# Altium schematic sheet Sheet3.SchDoc
size 431 x 279 mm; Organization: ORGANIZATION; Address1: ADDRESS 1; Address2: ADDRESS 2; Address3: ADDRESS 3; Address4: ADDRESS 4; Revision: -; ENG_APP_DATE: --/--/--; DSN_APP_DATE: --/--/--; CHK_APP_DATE: --/--/--
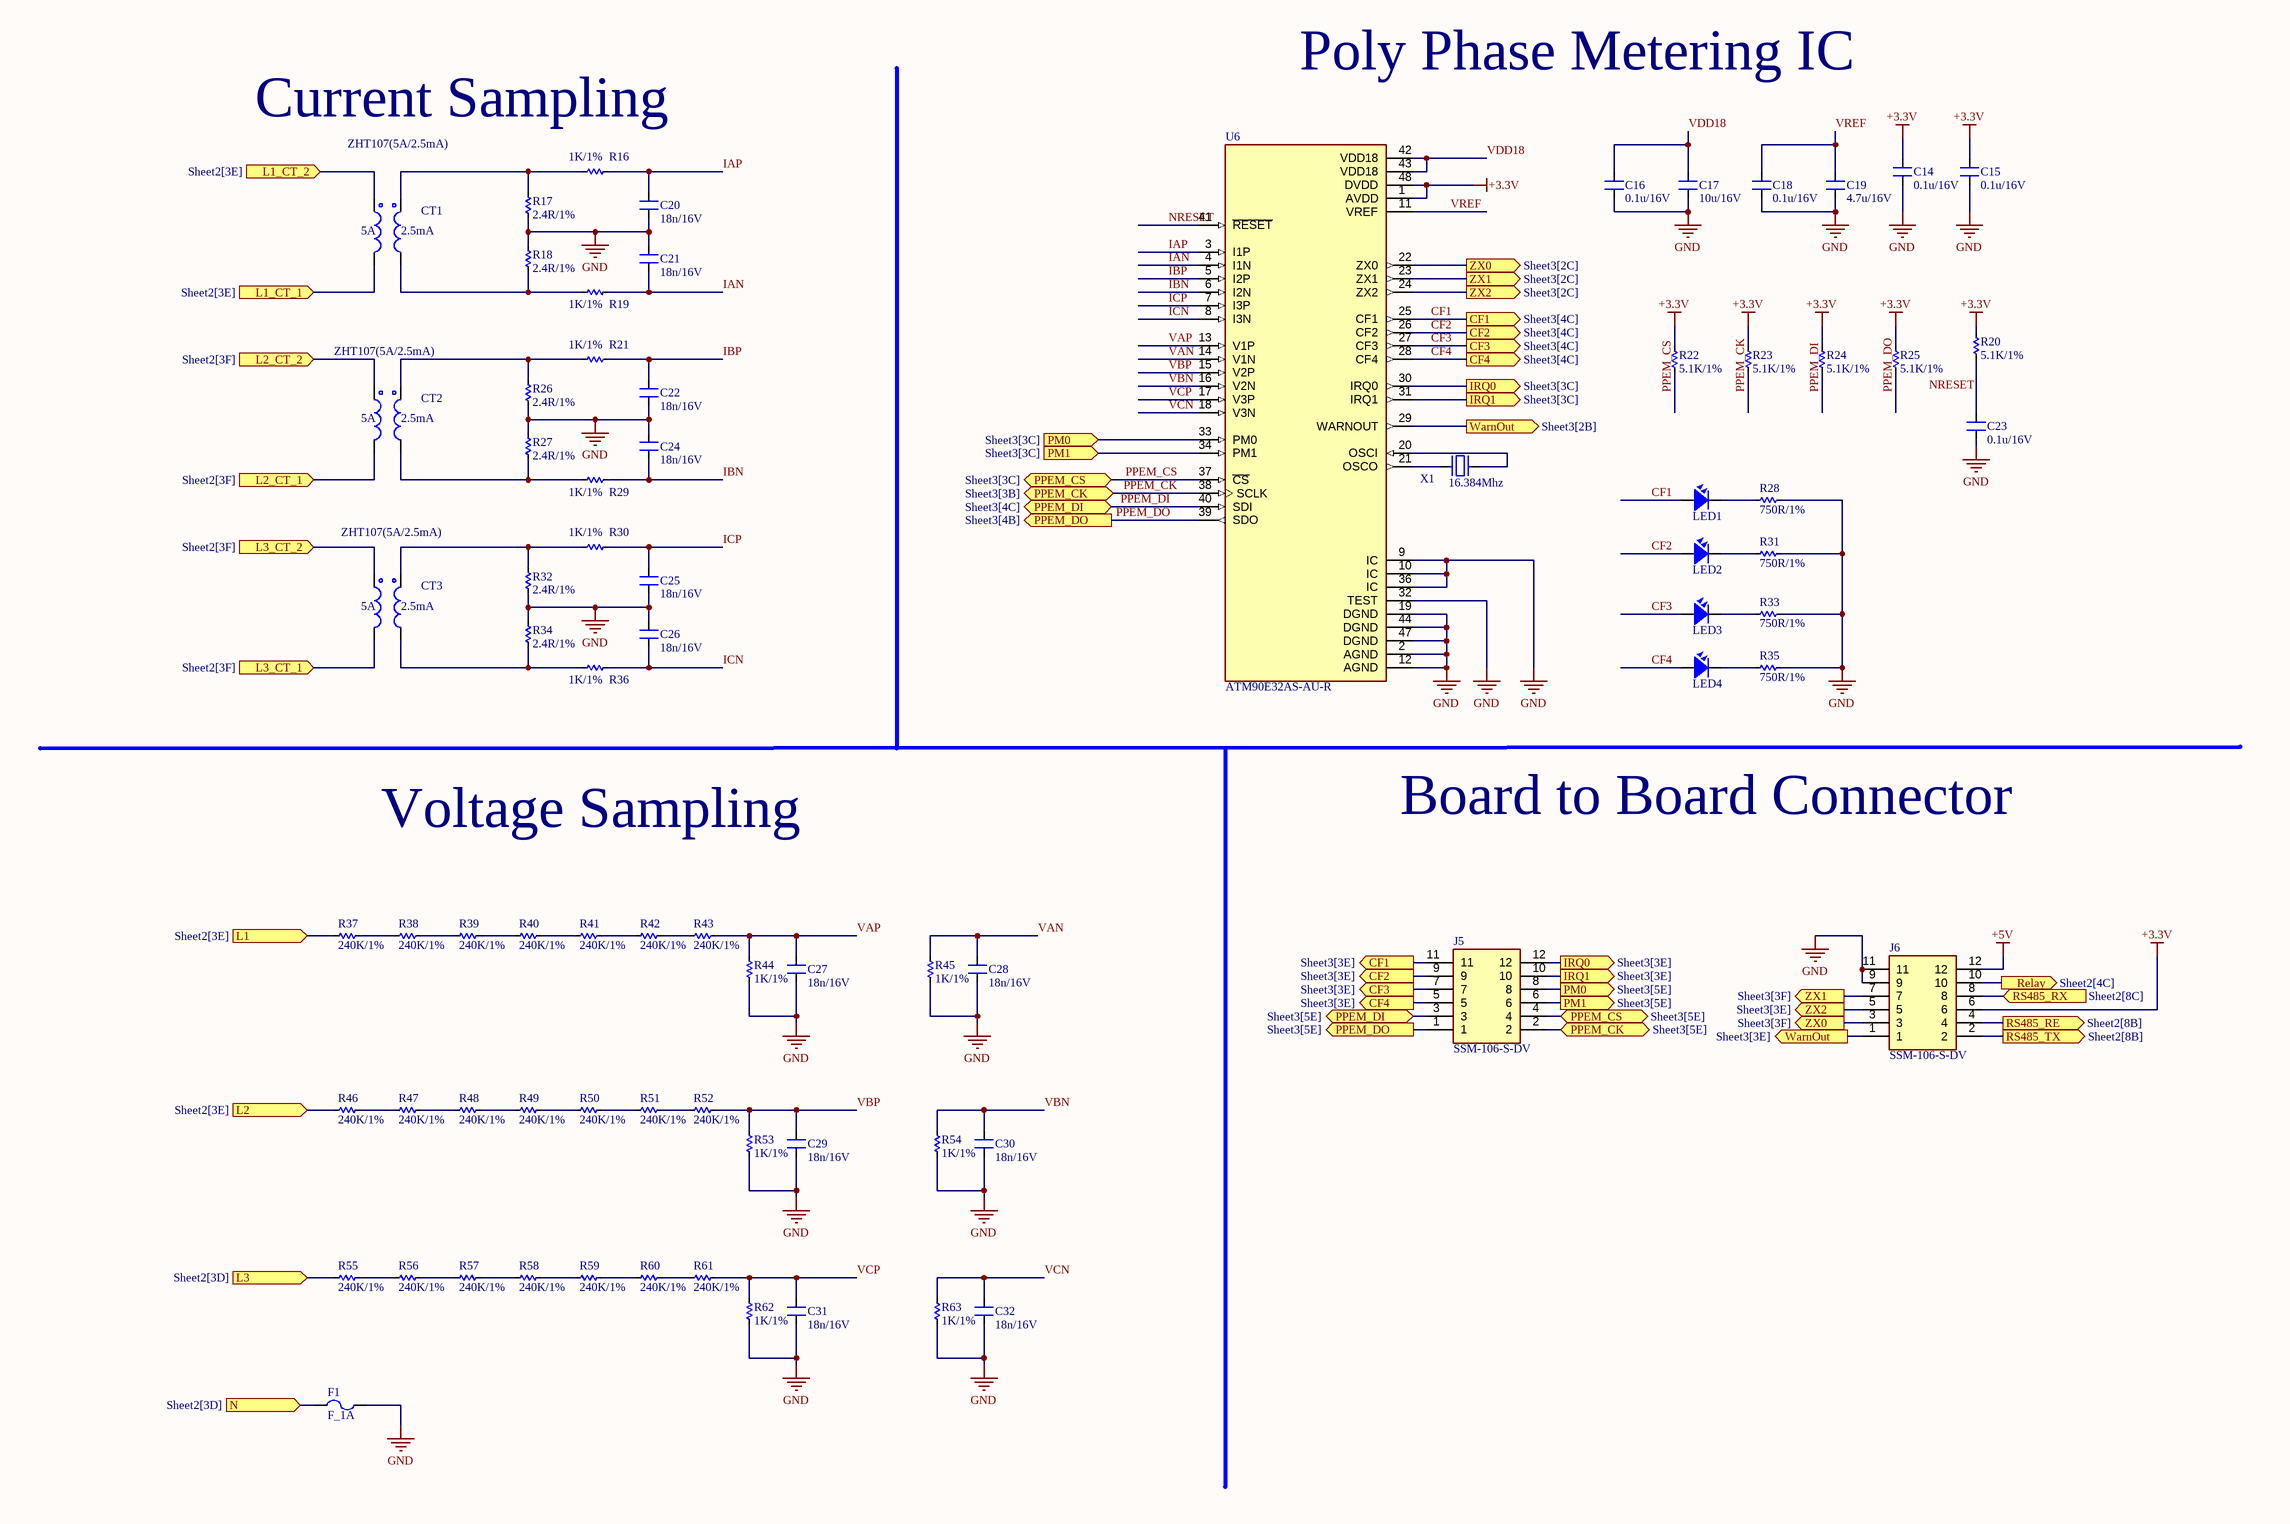
[diagram p0: Sheet3.SchDoc]

## Parts
C14  0.1u/16V  [CAP_C_2012X110]
C15  0.1u/16V  [CAP_C_2012X110]
C16  0.1u/16V  [CAP_C_2012X110]
C17  10u/16V  [CAP_C_2012X110]
C18  0.1u/16V  [CAP_C_2012X110]
C19  4.7u/16V  [CAP_C_2012X110]
C20  18n/16V  [CAP_C_2012X110]
C21  18n/16V  [CAP_C_2012X110]
C22  18n/16V  [CAP_C_2012X110]
C23  0.1u/16V  [CAP_C_2012X110]
C24  18n/16V  [CAP_C_2012X110]
C25  18n/16V  [CAP_C_2012X110]
C26  18n/16V  [CAP_C_2012X110]
C27  18n/16V  [CAP_C_2012X110]
C28  18n/16V  [CAP_C_2012X110]
C29  18n/16V  [CAP_C_2012X110]
C30  18n/16V  [CAP_C_2012X110]
C31  18n/16V  [CAP_C_2012X110]
C32  18n/16V  [CAP_C_2012X110]
CT1  ZHT107(5A/2.5mA)  [ZHT107]
CT2  ZHT107(5A/2.5mA)  [ZHT107]
CT3  ZHT107(5A/2.5mA)  [ZHT107]
F1  F_1A  [FUSC6127X294N]
J5  SSM-106-S-DV  [SSM-106-XXX-DV-BE]
J6  SSM-106-S-DV  [SSM-106-XXX-DV-BE]
LED1  LED  [LED-0805-Blue]  (value not drawn)
LED2  LED  [LED-0805-Blue]  (value not drawn)
LED3  LED  [LED-0805-Blue]  (value not drawn)
LED4  LED  [LED-0805-Blue]  (value not drawn)
R16  1K/1%  [RES_C_2012X65]
R17  2.4R/1%  [RES_C_2012X65]
R18  2.4R/1%  [RES_C_2012X65]
R19  1K/1%  [RES_C_2012X65]
R20  5.1K/1%  [RES_C_2012X65]
R21  1K/1%  [RES_C_2012X65]
R22  5.1K/1%  [RES_C_2012X65]
R23  5.1K/1%  [RES_C_2012X65]
R24  5.1K/1%  [RES_C_2012X65]
R25  5.1K/1%  [RES_C_2012X65]
R26  2.4R/1%  [RES_C_2012X65]
R27  2.4R/1%  [RES_C_2012X65]
R28  750R/1%  [RES_C_2012X65]
R29  1K/1%  [RES_C_2012X65]
R30  1K/1%  [RES_C_2012X65]
R31  750R/1%  [RES_C_2012X65]
R32  2.4R/1%  [RES_C_2012X65]
R33  750R/1%  [RES_C_2012X65]
R34  2.4R/1%  [RES_C_2012X65]
R35  750R/1%  [RES_C_2012X65]
R36  1K/1%  [RES_C_2012X65]
R37  240K/1%  [RES_C_2012X65]
R38  240K/1%  [RES_C_2012X65]
R39  240K/1%  [RES_C_2012X65]
R40  240K/1%  [RES_C_2012X65]
R41  240K/1%  [RES_C_2012X65]
R42  240K/1%  [RES_C_2012X65]
R43  240K/1%  [RES_C_2012X65]
R44  1K/1%  [RES_C_2012X65]
R45  1K/1%  [RES_C_2012X65]
R46  240K/1%  [RES_C_2012X65]
R47  240K/1%  [RES_C_2012X65]
R48  240K/1%  [RES_C_2012X65]
R49  240K/1%  [RES_C_2012X65]
R50  240K/1%  [RES_C_2012X65]
R51  240K/1%  [RES_C_2012X65]
R52  240K/1%  [RES_C_2012X65]
R53  1K/1%  [RES_C_2012X65]
R54  1K/1%  [RES_C_2012X65]
R55  240K/1%  [RES_C_2012X65]
R56  240K/1%  [RES_C_2012X65]
R57  240K/1%  [RES_C_2012X65]
R58  240K/1%  [RES_C_2012X65]
R59  240K/1%  [RES_C_2012X65]
R60  240K/1%  [RES_C_2012X65]
R61  240K/1%  [RES_C_2012X65]
R62  1K/1%  [RES_C_2012X65]
R63  1K/1%  [RES_C_2012X65]
U6  ATM90E32AS-AU-R  [TSQFP50P900X900X120-48N]
X1  16.384Mhz  [XT2-SMD]

## Ports
CF1 (out, see Sheet3[3E]), CF1 (out, see Sheet3[4C]), CF2 (out, see Sheet3[3E]), CF2 (out, see Sheet3[4C]), CF3 (out, see Sheet3[3E]), CF3 (out, see Sheet3[4C]), CF4 (out, see Sheet3[3E]), CF4 (out, see Sheet3[4C]), IRQ0 (out, see Sheet3[3C]), IRQ0 (out, see Sheet3[3E]), IRQ1 (out, see Sheet3[3C]), IRQ1 (out, see Sheet3[3E]), L1 (in, see Sheet2[3E]), L1_CT_1 (in, see Sheet2[3E]), L1_CT_2 (in, see Sheet2[3E]), L2 (in, see Sheet2[3E]), L2_CT_1 (in, see Sheet2[3F]), L2_CT_2 (in, see Sheet2[3F]), L3 (in, see Sheet2[3D]), L3_CT_1 (in, see Sheet2[3F]), L3_CT_2 (in, see Sheet2[3F]), N (in, see Sheet2[3D]), PM0 (in, see Sheet3[3C]), PM0 (out, see Sheet3[5E]), PM1 (in, see Sheet3[3C]), PM1 (out, see Sheet3[5E]), PPEM_CK (bidir, see Sheet3[3B]), PPEM_CK (bidir, see Sheet3[5E]), PPEM_CS (bidir, see Sheet3[3C]), PPEM_CS (bidir, see Sheet3[5E]), PPEM_DI (bidir, see Sheet3[4C]), PPEM_DI (bidir, see Sheet3[5E]), PPEM_DO (out, see Sheet3[4B]), PPEM_DO (out, see Sheet3[5E]), Relay (out, see Sheet2[4C]), RS485_RE (out, see Sheet2[8B]), RS485_RX (in, see Sheet2[8C]), RS485_TX (out, see Sheet2[8B]), WarnOut (out, see Sheet3[2B]), WarnOut (out, see Sheet3[3E]), ZX0 (out, see Sheet3[2C]), ZX0 (out, see Sheet3[3F]), ZX1 (out, see Sheet3[2C]), ZX1 (out, see Sheet3[3F]), ZX2 (out, see Sheet3[2C]), ZX2 (out, see Sheet3[3E])

## Nets
+3.3V: C14.2 C15.2 J6.6 R20.2 R22.2 R23.2 R24.2 R25.2 U6.1(AVDD) U6.48(DVDD)
+5V: J6.12
GND: C14.1 C15.1 C16.1 C17.1 C18.1 C19.1 C20.1 C21.2 C22.1 C23.1 C24.2 C25.1 C26.2 C27.1 C28.1 C29.1 C30.1 C31.1 C32.1 F1.2 J6.9 J6.11 R17.2 R18.1 R26.2 R27.1 R28.2 R31.2 R32.2 R33.2 R34.1 R35.2 R44.2 R45.2 R53.2 R54.2 R62.2 R63.2 U6.2(AGND) U6.9(IC) U6.10(IC) U6.12(AGND) U6.19(DGND) U6.32(TEST) U6.36(IC) U6.44(DGND) U6.47(DGND)
CF1: J5.11 LED1.1 U6.25(CF1) ; port CF1
CF2: J5.9 LED2.1 U6.26(CF2) ; port CF2
CF3: J5.7 LED3.1 U6.27(CF3) ; port CF3
CF4: J5.5 LED4.1 U6.28(CF4) ; port CF4
IAN: C21.1 R19.2 U6.4(I1N)
IAP: C20.2 R16.2 U6.3(I1P)
IBN: C24.1 R29.2 U6.6(I2N)
IBP: C22.2 R21.2 U6.5(I2P)
ICN: C26.1 R36.2 U6.8(I3N)
ICP: C25.2 R30.2 U6.7(I3P)
IRQ0: J5.12 U6.30(IRQ0) ; port IRQ0
IRQ1: J5.10 U6.31(IRQ1) ; port IRQ1
L1: R37.2 ; port L1
L1_CT_1: CT1.2 ; port L1_CT_1
L1_CT_2: CT1.1 ; port L1_CT_2
L2: R46.2 ; port L2
L2_CT_1: CT2.2 ; port L2_CT_1
L2_CT_2: CT2.1 ; port L2_CT_2
L3: R55.2 ; port L3
L3_CT_1: CT3.2 ; port L3_CT_1
L3_CT_2: CT3.1 ; port L3_CT_2
N: F1.1 ; port N
NRESET: C23.2 R20.1 U6.41(~{RESET})
PM0: J5.8 U6.33(PM0) ; port PM0
PM1: J5.6 U6.34(PM1) ; port PM1
PPEM_CK: J5.2 R23.1 U6.38(SCLK) ; port PPEM_CK
PPEM_CS: J5.4 R22.1 U6.37(~{CS}) ; port PPEM_CS
PPEM_DI: J5.3 R24.1 U6.40(SDI) ; port PPEM_DI
PPEM_DO: J5.1 R25.1 U6.39(SDO) ; port PPEM_DO
Relay: J6.10 ; port Relay
RS485_RE: J6.4 ; port RS485_RE
RS485_RX: J6.8 ; port RS485_RX
RS485_TX: J6.2 ; port RS485_TX
VAN: C28.2 R45.1 U6.14(V1N)
VAP: C27.2 R43.1 R44.1 U6.13(V1P)
VBN: C30.2 R54.1 U6.16(V2N)
VBP: C29.2 R52.1 R53.1 U6.15(V2P)
VCN: C32.2 R63.1 U6.18(V3N)
VCP: C31.2 R61.1 R62.1 U6.17(V3P)
VDD18: C16.2 C17.2 U6.42(VDD18) U6.43(VDD18)
VREF: C18.2 C19.2 U6.11(VREF)
WarnOut: J6.1 U6.29(WARNOUT) ; port WarnOut
ZX0: J6.3 U6.22(ZX0) ; port ZX0
ZX1: J6.7 U6.23(ZX1) ; port ZX1
ZX2: J6.5 U6.24(ZX2) ; port ZX2
NetCT1_3: CT1.3 R16.1 R17.1
NetCT1_4: CT1.4 R18.2 R19.1
NetCT2_3: CT2.3 R21.1 R26.1
NetCT2_4: CT2.4 R27.2 R29.1
NetCT3_3: CT3.3 R30.1 R32.1
NetCT3_4: CT3.4 R34.2 R36.1
NetLED1_2: LED1.2 R28.1
NetLED2_2: LED2.2 R31.1
NetLED3_2: LED3.2 R33.1
NetLED4_2: LED4.2 R35.1
NetR37_1: R37.1 R38.2
NetR38_1: R38.1 R39.2
NetR39_1: R39.1 R40.2
NetR40_1: R40.1 R41.2
NetR41_1: R41.1 R42.2
NetR42_1: R42.1 R43.2
NetR46_1: R46.1 R47.2
NetR47_1: R47.1 R48.2
NetR48_1: R48.1 R49.2
NetR49_1: R49.1 R50.2
NetR50_1: R50.1 R51.2
NetR51_1: R51.1 R52.2
NetR55_1: R55.1 R56.2
NetR56_1: R56.1 R57.2
NetR57_1: R57.1 R58.2
NetR58_1: R58.1 R59.2
NetR59_1: R59.1 R60.2
NetR60_1: R60.1 R61.2
NetU6_20: U6.20(OSCI) X1.1
NetU6_21: U6.21(OSCO) X1.2

## Notes on the sheet
- (near R16) Current Sampling
- Poly Phase Metering IC
- Voltage Sampling
- Board to Board Connector
- (in symbol ZHT-107) 5A; 2.5mA

## Library data of the parts
C14-C32 = CAP_SMD
CT1-CT3 = ZHT-107: C5183046
F1 = Fuse: Designed by: VanDungEvn; Value: Fuse
J5 J6 = SSM-106-S-DV: Connector; Manufacturer_Name: SAMTEC; Manufacturer_Part_Number: SSM-105-S-DV; Datasheet Link: https://mm.digikey.com/Volume0/opasdata/d220001/medias/docus/6129/ssm-1xx-xxx-dv-xx-xx-xxx-x-xx-mkt.pdf; Mouser Part Number: 200-SSM105SDV; Mouser Price/Stock: https://www.mouser.co.uk/ProductDetail/Samtec/SSM-105-S-DV?qs=XtX6y9BSeMiNY1vJI%2FFCQQ%3D%3D; Arrow Part Number: SSM-105-S-DV; Arrow Price/Stock: https://www.arrow.com/en/products/ssm-105-s-dv/samtec; LCSC Part #: *
LED1-LED4 = LED SMD: Value: LED 3 - 5 ly 2 Colour
R16-R63 = Res-SMD: Resistor; Manufacturer: Generic Components; Class: Passive; Published: 08/06/2000; Publisher: Altium Hobart Technology Centre
U6 = ATM90E32AS-AU-R: IC ENERGY METER 1.8V/3V 48TQFP; MF: Microchip; SnapEDA_Link: https://www.snapeda.com/parts/ATM90E32AS-AU-R/Microchip/view-part/592639/?ref=snap; MP: ATM90E32AS-AU-R; Availability: Warning; Price: None; Value: *; Purchase-URL: https://pricing.snapeda.com/search/part/ATM90E32AS-AU-R/?ref=eda; Package: TQFP-48 Microchip
X1 = XT2: Crystal, 32.768 KHz, -40 to 85 degC, 3.2 x 1.5 x 0.9 mm SMD; Value: 4Mhz